# Altium schematic sheet LTC2990 Breakout.SchDoc: LTC2990 Breakout
size A4; DocumentNumber: 1; Revision: 1.0; SheetNumber: 1; SheetTotal: 1
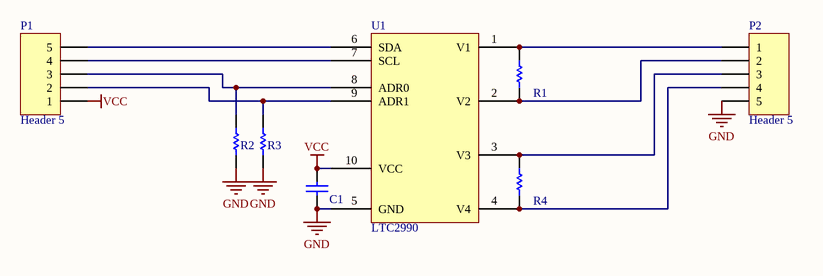
[diagram p0: LTC2990 Breakout.SchDoc]

## Parts
C1  CAP 1uF 35V 0805(2012)  [CAPC0805(2012)145_L]  (value not drawn)
P1  Header 5  [HDR1X5]
P2  Header 5  [HDR1X5]
R1  1R 5% 0805(2012)  [RESC0805(2012)_L]  (value not drawn)
R2  10K 5% 0805(2012)  [RESC0805(2012)_L]  (value not drawn)
R3  10K 5% 0805(2012)  [RESC0805(2012)_L]  (value not drawn)
R4  1R 5% 0805(2012)  [RESC0805(2012)_L]  (value not drawn)
U1  LTC2990  [LT-MS 10-MSOP]

## Nets
GND: C1.1 P2.5 R2.2 R3.2 U1.5(GND)
VCC: C1.2 P1.1 U1.10(VCC)
NetP1_2: P1.2 R3.1 U1.9(ADR1)
NetP1_3: P1.3 R2.1 U1.8(ADR0)
NetP1_4: P1.4 U1.7(SCL)
NetP1_5: P1.5 U1.6(SDA)
NetP2_1: P2.1 R1.2 U1.1(V1)
NetP2_2: P2.2 R1.1 U1.2(V2)
NetP2_3: P2.3 R4.2 U1.3(V3)
NetP2_4: P2.4 R4.1 U1.4(V4)

## Notes on the sheet
- Title
- Size:
- Date:
- A4
- Number:
- Time:
- Revision:
- Sheet
- of
- File:

## Library data of the parts
C1 = CMP-1036-04759-1: CAP 1uF 35V ±10% 0805 (2012 Metric) Thickness 1.45mm SMD; Case-Metric: 2012; Case-EIA: 0805; Value: 1uF; Tolerance: ±10%; Technology: SMT; Rated Voltage: 35 V; Max Thickness: 1.45 mm
P1 P2 = Header 5: Header, 5-Pin; LatestRevisionDate: 17-Jul-2002; LatestRevisionNote: Re-released for DXP Platform.; Publisher: Altium Limited
R1 R4 = CMP-1013-00002-1: 1R 0.125W 5% 0805 (2012 Metric)  SMD; Value: 1.00 Ohm; Case-EIA: 0805; Case-Metric: 2012; Power: 0.125 W; Tolerance: 5 %; Technology: SMT
R2 R3 = CMP-1013-00098-1: 10K 0.125W 5% 0805 (2012 Metric)  SMD; Case-EIA: 0805; Case-Metric: 2012; Value: 10000.00 Ohm; Power: 0.125 W; Technology: SMT; Tolerance: 5 %
U1 = LTC2990: Quad I2C Voltage, Current and Temperature Monitor